# EAGLE design pingLED (EAGLE 9.3.1)
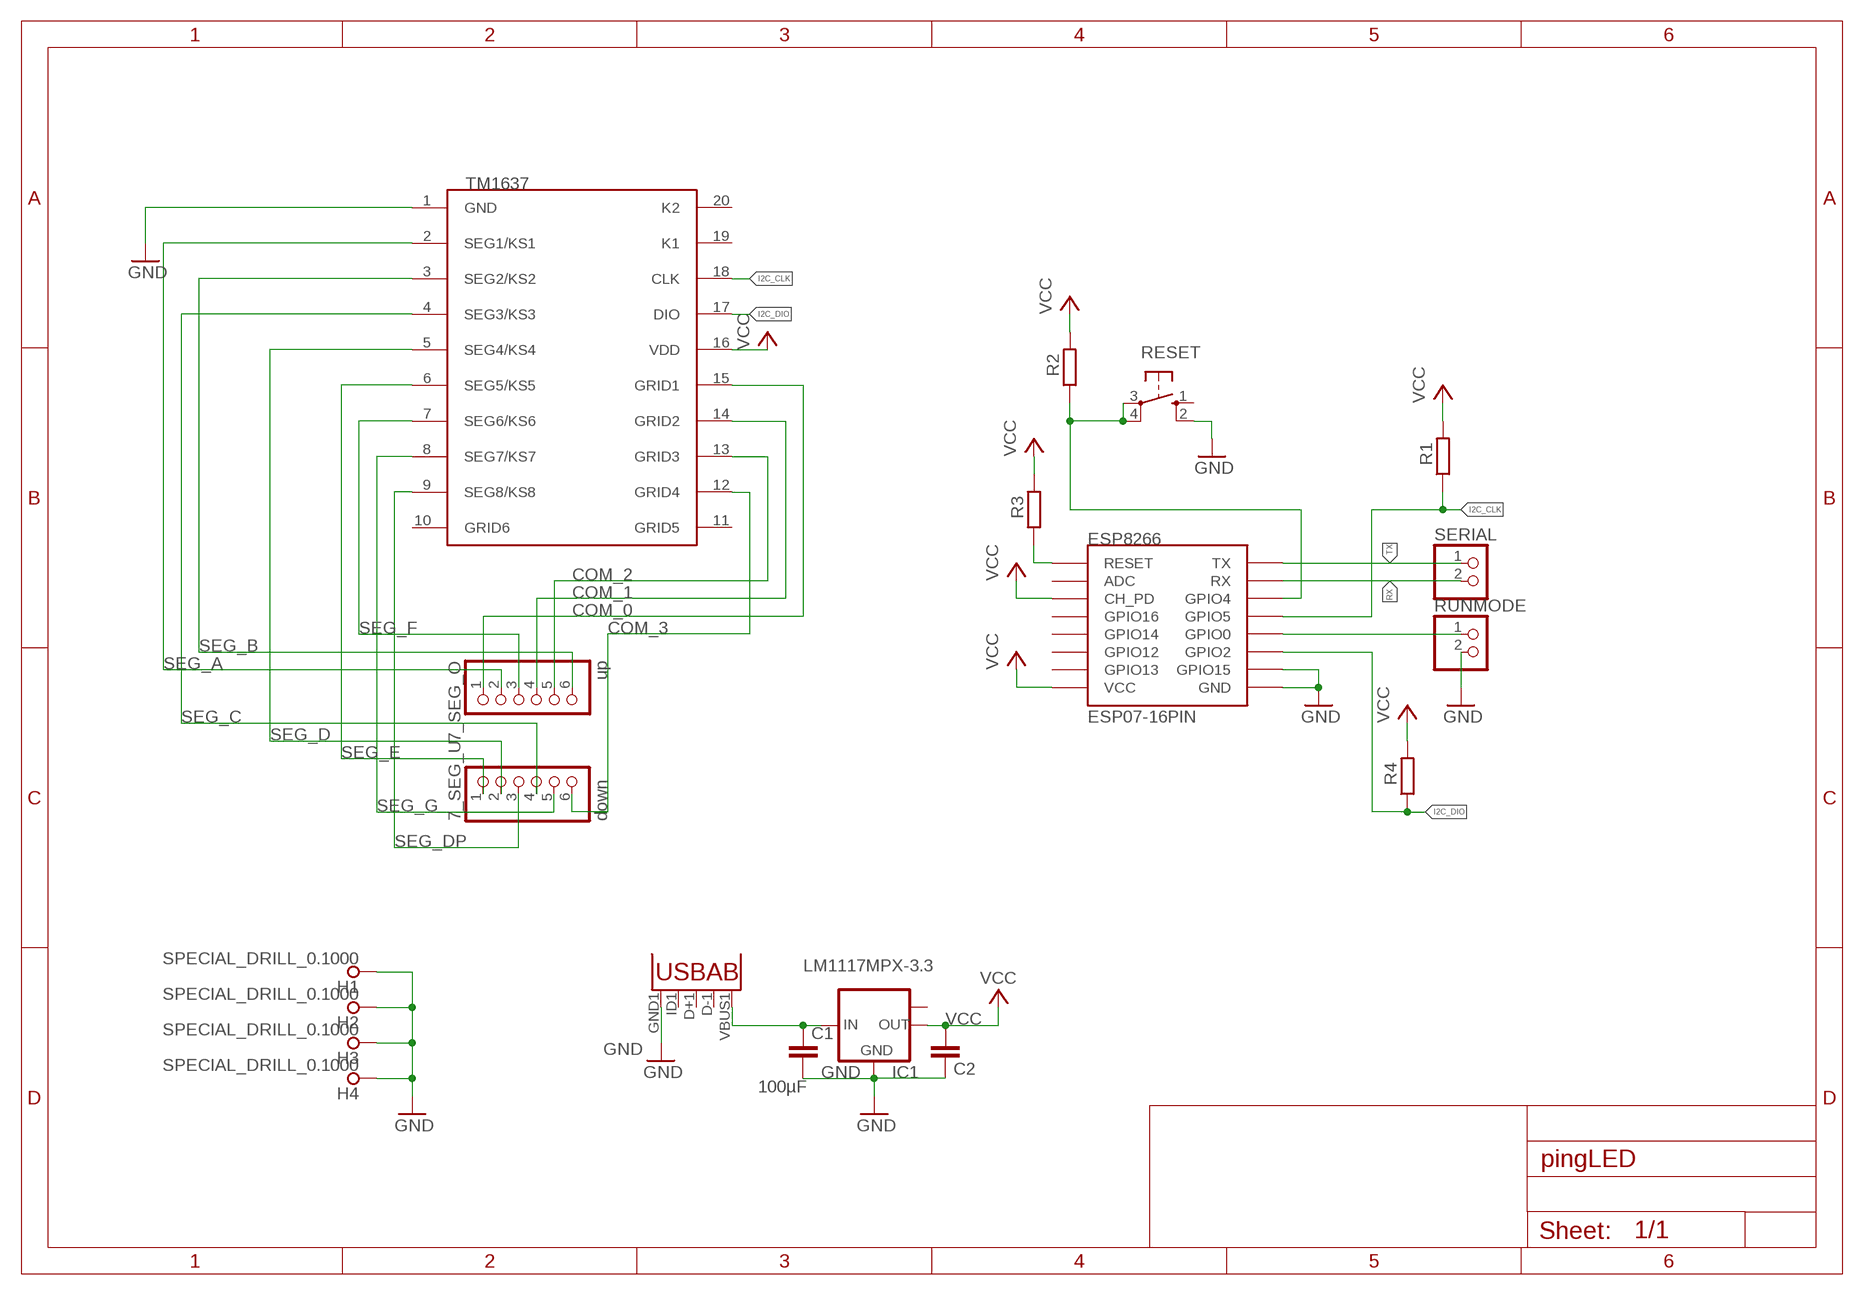
[diagram p0: schematic, sheet 1]

## Parts
7_SEG_O  up  PINHD-1X6  [1X06]
7_SEG_U  down  PINHD-1X6  [1X06]
7SEG_DRIVER  TM1637SOP20  [SOIC127P1045X255-20]
C1  100µF  C-EUC0603  [C0603]
C2  C-EUC0603  [C0603]
ESP8266  ESP07-16PIN  [ESP07-16PIN]
H1  SPECIAL_DRILL_0.1000  [PAD_0.1000]
H2  SPECIAL_DRILL_0.1000  [PAD_0.1000]
H3  SPECIAL_DRILL_0.1000  [PAD_0.1000]
H4  SPECIAL_DRILL_0.1000  [PAD_0.1000]
IC1  LM1117MPX-3.3  [SOT223]
R1  R-EU_R0603  [R0603]
R2  R-EU_R0603  [R0603]
R3  R-EU_R0603  [R0603]
R4  R-EU_R0603  [R0603]
RESET  10-XX  [B3F-10XX]
RUNMODE  PINHD-1X2  [1X02]
SERIAL  PINHD-1X2  [1X02]
U1  V_IN  USB""  [USB-MICRO-SMD]

## Nets
COM_0: 7_SEG_O.1 7SEG_DRIVER.15(GRID1)
COM_1: 7_SEG_O.4 7SEG_DRIVER.14(GRID2)
COM_2: 7_SEG_O.5 7SEG_DRIVER.13(GRID3)
COM_3: 7_SEG_U.6 7SEG_DRIVER.12(GRID4)
GND: 7SEG_DRIVER.1(GND) C1.2 C2.2 ESP8266.GND ESP8266.GPIO15 H1.1 H2.1 H3.1 H4.1 IC1.1(GND) RESET.2(S1) RUNMODE.2 U1.GND1(GND)
I2C_CLK: 7SEG_DRIVER.18(CLK) ESP8266.GPIO5 R1.1
I2C_DIO: 7SEG_DRIVER.17(DIO) ESP8266.GPIO2 R4.1
N$1: ESP8266.GPIO0 RUNMODE.1
N$2: ESP8266.GPIO4 R2.1 RESET.3(P) RESET.4(P1)
N$3: ESP8266.REST(RESET) R3.1
N$4: C1.1 IC1.3(IN) U1.VBUS1(VBUS)
RX: ESP8266.RX SERIAL.2
SEG_A: 7_SEG_O.2 7SEG_DRIVER.2(SEG1/KS1)
SEG_B: 7_SEG_O.6 7SEG_DRIVER.3(SEG2/KS2)
SEG_C: 7_SEG_U.4 7SEG_DRIVER.4(SEG3/KS3)
SEG_D: 7_SEG_U.2 7SEG_DRIVER.5(SEG4/KS4)
SEG_DP: 7_SEG_U.3 7SEG_DRIVER.9(SEG8/KS8)
SEG_E: 7_SEG_U.1 7SEG_DRIVER.6(SEG5/KS5)
SEG_F: 7_SEG_O.3 7SEG_DRIVER.7(SEG6/KS6)
SEG_G: 7_SEG_U.5 7SEG_DRIVER.8(SEG7/KS7)
TX: ESP8266.TX SERIAL.1
VCC: 7SEG_DRIVER.16(VDD) C2.1 ESP8266.CH_PD ESP8266.VCC IC1.2(OUT) R1.2 R2.2 R3.2 R4.2
Unconnected: 7SEG_DRIVER.10(GRID6) 7SEG_DRIVER.11(GRID5) 7SEG_DRIVER.19(K1) 7SEG_DRIVER.20(K2) ESP8266.ADC ESP8266.GPIO12 ESP8266.GPIO13 ESP8266.GPIO14 ESP8266.GPIO16 IC1.TAB(OUT1) RESET.1(S) U1.D+1(D+) U1.D-1(D-) U1.ID1(USBID)

## Library data of the parts
7_SEG_O 7_SEG_U = adafruit:PINHD-1X6: PIN HEADER
7SEG_DRIVER = esp8266:TM1637
C1 C2 = rcl:C-EU: CAPACITOR, European symbol; SPICEPREFIX: C
ESP8266 = esp8266:ESP07-16PIN: ESP8266 Wifi module 07 - 16 pins; DIMENSIONS: 22.0 x 16.0 mm; PINS: 16; PITCH: 0.078" / 2 mm
H1-H4 = special-drill:SPECIAL_DRILL_: Special drills
IC1 = lm1117:LM1117MPX-*
R1-R4 = rcl:R-EU_: RESISTOR, European symbol; SPICEPREFIX: R
RESET = switch-omron:10-XX: OMRON SWITCH; MPN: B3F-1000; OC_FARNELL: 176432; OC_NEWARK: 36M3542
RUNMODE SERIAL = pinhead:PINHD-1X2: PIN HEADER
U1 = MicroUSB:USB: This is a USB AB connector that is compatible with USB OTG. i.e. this connector can serve as a host or device

## Board
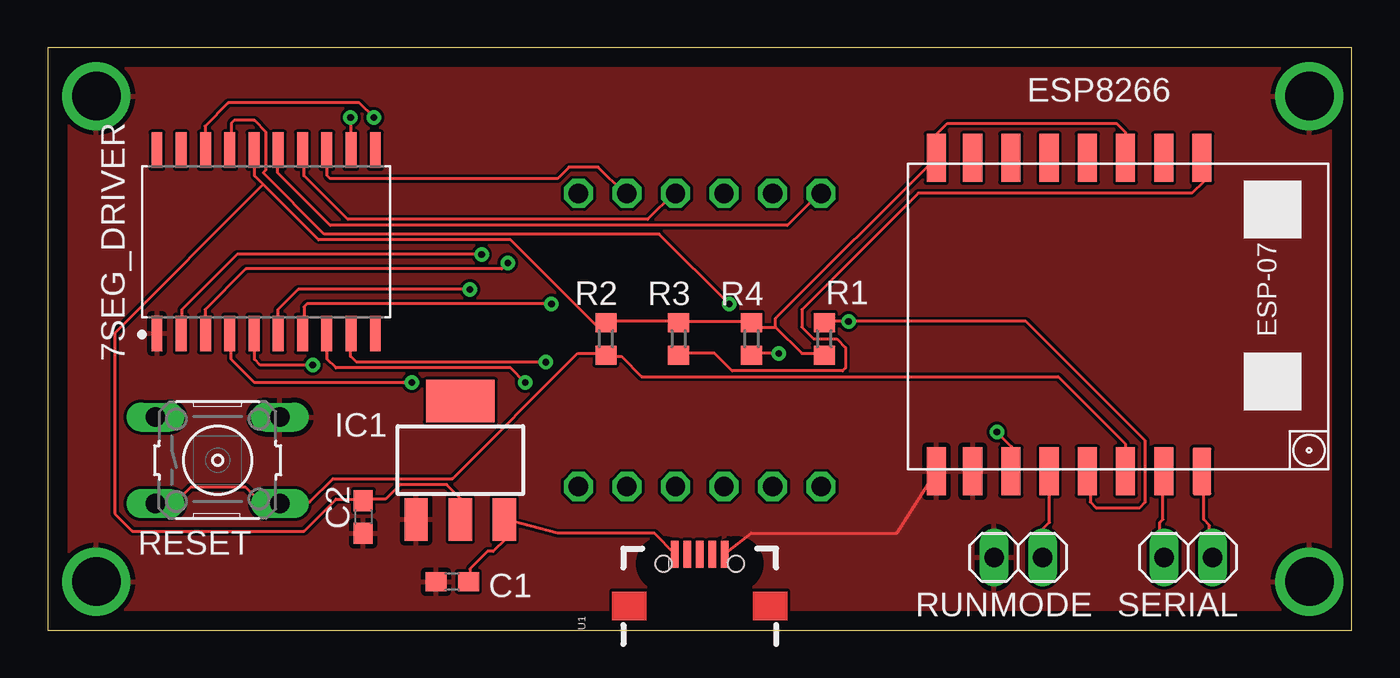
[diagram p1: board, top side]
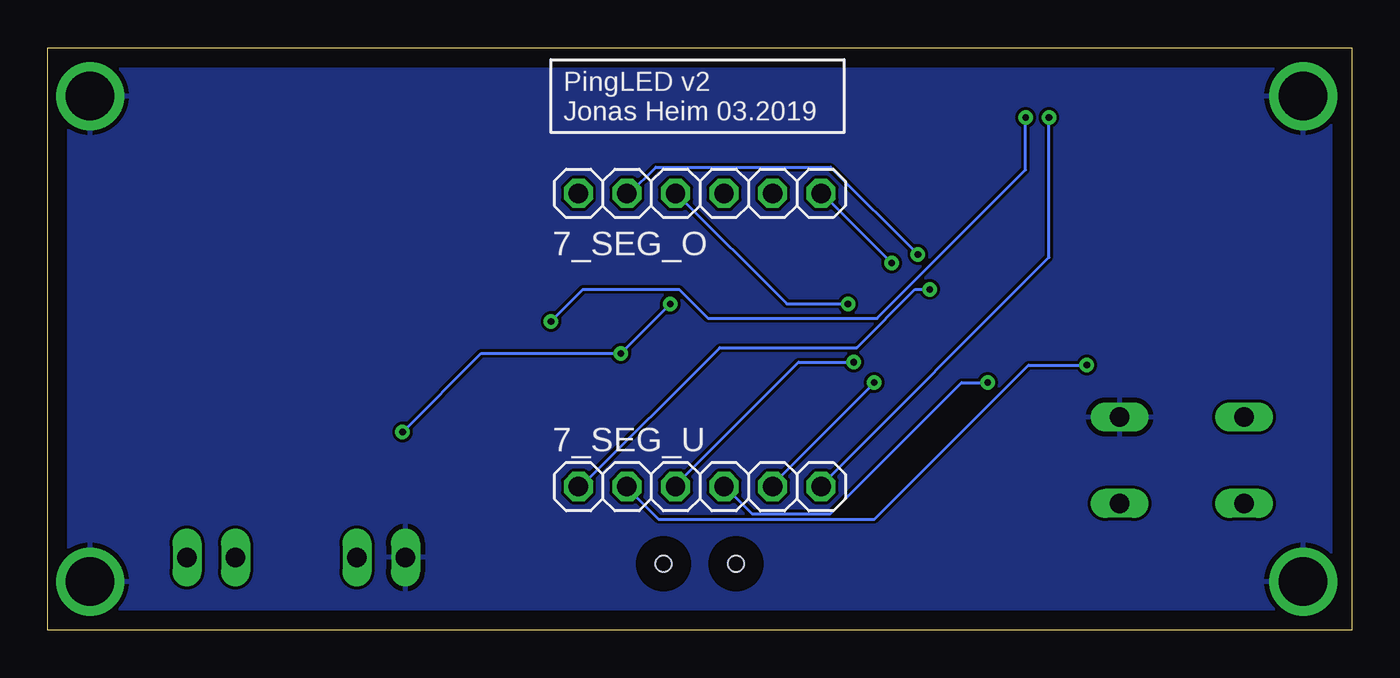
[diagram p2: board, bottom side, seen from below]

Size 68.25 x 30.47 mm. Coordinates in mm from the lower left corner, seen from the top.
Outline: 0,0 68.25,0 68.25,30.47 0,30.47 0,0
Copper layers (1*16): Top 0.035mm / dielectric 1.5mm / Bottom 0.035mm
Design rules "default *": minimum track width 6mil, minimum drill 0.35mm, track to track 6mil, track to pad 6mil, pad to pad 6mil, via to via 12mil, smd to smd 6mil, copper to edge 40mil, drill to drill 6mil, minimum pad ring 10mil, minimum via ring 8mil, stop-mask expansion 4mil, vias tented up to drill 0mil, thermal gap 10mil

### Footprints (pad centres in the part's own frame; a part is rotated, then mirrored left to right if it is on the bottom)
1X06 = drill 1.016 octagon: 1 -6.35,0; 2 -3.81,0; 3 -1.27,0; 4 1.27,0; 5 3.81,0; 6 6.35,0
SOIC127P1045X255-20 = smd 1.865 x 0.572: 1 -4.798,5.715; 2 -4.798,4.445; 3 -4.798,3.175; 4 -4.798,1.905; 5 -4.798,0.635; 6 -4.798,-0.635; 7 -4.798,-1.905; 8 -4.798,-3.175; 9 -4.798,-4.445; 10 -4.798,-5.715; 11 4.798,-5.715; 12 4.798,-4.445; 13 4.798,-3.175; 14 4.798,-1.905; 15 4.798,-0.635; 16 4.798,0.635; 17 4.798,1.905; 18 4.798,3.175; 19 4.798,4.445; 20 4.798,5.715
C0603 = smd 1.1 x 1: 1 -0.85,0; 2 0.85,0
ESP07-16PIN = smd 2.5 x 1: ADC -8.2,3.8; CH_PD -8.2,1.8; GND 8.2,-8.105; GPIO0 8.2,-2.2; GPIO2 8.2,-4.2; GPIO4 8.2,1.8; GPIO5 8.2,-0.2; GPIO12 -8.2,-4.2; GPIO13 -8.2,-6.2; GPIO14 -8.2,-2.2; GPIO15 8.2,-6.2; GPIO16 -8.2,-0.2; REST -8.2,5.8; RX 8.2,3.8; TX 8.2,5.8; VCC -8.2,-8.105
PAD_0.1000 = drill 2.54 pad 2.54: 1 0,0
SOT223 = smd 1.219 x 2.235: 1 -2.311,-3.099; 2 0,-3.099; 3 2.311,-3.099 | smd 3.6 x 2.2: TAB 0,3.099
R0603 = smd 1 x 1.1: 1 -0.85,0; 2 0.85,0
B3F-10XX = drill 1.016 long: 1 -3.251,2.261; 2 3.251,2.261; 3 -3.251,-2.261; 4 3.251,-2.261
1X02 = drill 1.016 long: 1 -1.27,0; 2 1.27,0
USB-MICRO-SMD = smd 1.4 x 0.4: D+1 2.7,0; D-1 2.7,0.65; GND1 2.7,-1.3; ID1 2.7,-0.65; VBUS1 2.7,1.3 | hole 0.85: 2.2,1.9; 2.2,-1.9

### Placement (x,y rotation side)
7_SEG_O  34.12,22.85 0 bottom
7_SEG_U  34.12,7.51 0 bottom
7SEG_DRIVER  11.43,20.32 90 top
C1  21.17,2.54 180 top
C2  16.51,5.93 270 top
ESP8266  54.61,16.51 270 top
H1  2.54,2.54 0 top
H2  66.04,2.54 0 top
H3  2.54,27.94 0 top
H4  66.04,27.94 0 top
IC1  21.59,8.89 0 top
R1  40.64,15.24 270 top
R2  29.21,15.24 90 top
R3  33.02,15.24 90 top
R4  36.83,15.24 90 top
RESET  8.89,8.89 0 top
RUNMODE  50.8,3.81 180 top
SERIAL  59.69,3.81 180 top
U1  34.12,1.27 90 top

### Tracks (layer width: path | path; a pad name or v marks a point on that pad's centre or on a via)
COM_0
  Top 0.152: 7SEG_DRIVER.15 12.04,24.99 12.04,23.93 14.78,21.18 38.71,21.18 40.39,22.86 7_SEG_O.1
COM_1
  Top 0.152: 7SEG_DRIVER.14 13.41,24.99 13.41,23.77 15.7,21.49 31.39,21.49 32.77,22.86 7_SEG_O.4
COM_2
  Top 0.152: 7SEG_DRIVER.13 14.63,24.99 14.63,23.77 14.78,23.62 26.67,23.62 27.28,24.23 28.8,24.23 30.18,22.86 7_SEG_O.5
COM_3  (via drill 0.35)
  Top 0.152: v15.85,26.82 15.85,25.15 7SEG_DRIVER.12
  Bottom 0.152: v15.85,26.82 15.85,19.51 27.74,7.62 7_SEG_U.6
GND
  Top 0.152: U1.GND1 36.83,5.08 44.45,5.08 ESP8266.GND
  pour Top: 0,30.48 0,0 68.58,0 68.58,30.48
  pour Bottom: 0,30.48 0,0 68.58,0 68.58,30.48
I2C_CLK  (via drill 0.35)
  Top 0.152: R1.1 40.69,16.15 v41.91,16.15 51.21,16.15 57.45,9.91 57.45,6.71 57.15,6.4 54.86,6.4 54.56,6.71 54.56,8.23 ESP8266.GPIO5 | v17.07,26.82 16.31,27.58 9.45,27.58 8.23,26.36 8.23,25.15 7SEG_DRIVER.18
  Bottom 0.152: v17.07,26.82 17.07,24.08 24.84,16.31 33.68,16.31 35.2,17.83 40.23,17.83 v41.91,16.15
I2C_DIO  (via drill 0.35)
  Top 0.152: v38.25,14.48 36.88,14.48 R4.1 | v49.68,10.36 50.44,9.6 50.44,8.38 ESP8266.GPIO2 | v35.66,17.07 32,20.73 14.48,20.73 11.28,23.93 11.43,24.08 11.43,26.06 10.82,26.67 9.75,26.67 9.6,26.52 9.6,25.15 7SEG_DRIVER.17
  Bottom 0.152: v49.68,10.36 45.57,14.48 v38.25,14.48 v35.66,17.07
N$1
  Top 0.152: ESP8266.GPIO0 52.43,8.23 52.43,5.64 52.12,5.33 52.12,3.81 RUNMODE.1
N$2
  Top 0.152: ESP8266.GPIO4 56.39,8.38 56.39,9.75 52.88,13.26 31.09,13.26 30.02,14.33 29.26,14.33 R2.1 29.11,14.48 27.74,14.48 21.18,7.92 14.94,7.92 13.72,6.71 12.19,6.71 RESET.4 12.04,6.71 11.12,6.71 10.36,7.47 7.47,7.47 6.71,6.71 5.64,6.71 RESET.3
N$3
  Top 0.152: R3.1 33.07,14.48 34.9,14.48 35.81,13.56 41.6,13.56 41.76,13.72 41.76,14.78 41.3,15.24 40.08,15.24 39.47,15.85 39.47,16.76 45.57,22.86 59.89,22.86 60.5,23.47 60.5,24.69 ESP8266.REST
N$4
  Top 0.152: U1.VBUS1 31.75,5.08 26.67,5.08 IC1.3 23.93,5.64 23.93,4.72 23.32,4.12 23.01,4.12 22.1,3.2 22.1,2.59 C1.1
RX
  Top 0.152: ESP8266.RX 58.37,8.23 58.37,5.79 58.22,5.64 58.22,3.96 58.37,3.81 SERIAL.2
SEG_A  (via drill 0.35)
  Top 0.152: v22.71,19.66 9.91,19.66 7.01,16.76 7.01,15.54 7SEG_DRIVER.2
  Bottom 0.152: v22.71,19.66 27.28,24.23 36.42,24.23 37.8,22.86 7_SEG_O.2
SEG_B  (via drill 0.35)
  Top 0.152: v24.08,19.2 23.77,18.9 10.36,18.9 8.23,16.76 8.23,15.54 7SEG_DRIVER.3
  Bottom 0.152: v24.08,19.2 27.74,22.86 7_SEG_O.6
SEG_C  (via drill 0.35)
  Top 0.152: v19.05,12.95 10.82,12.95 9.6,14.17 9.6,15.39 7SEG_DRIVER.4
  Bottom 0.152: v19.05,12.95 20.42,12.95 27.28,6.1 31.39,6.1 32.77,7.47 7_SEG_U.4
SEG_D  (via drill 0.35)
  Top 0.152: v13.87,13.87 11.12,13.87 10.82,14.17 10.82,15.39 7SEG_DRIVER.5
  Bottom 0.152: v13.87,13.87 16.92,13.87 24.99,5.79 36.27,5.79 37.95,7.47 7_SEG_U.2
SEG_DP  (via drill 0.35)
  Top 0.152: v26.06,14.02 16.15,14.02 15.85,14.33 15.85,15.39 7SEG_DRIVER.9
  Bottom 0.152: v26.06,14.02 28.96,14.02 35.36,7.62 7_SEG_U.3
SEG_E  (via drill 0.35)
  Top 0.152: v22.1,17.83 13.11,17.83 12.04,16.76 12.04,15.54 7SEG_DRIVER.6
  Bottom 0.152: v22.1,17.83 22.86,17.83 25.91,14.78 33.07,14.78 40.39,7.47 7_SEG_U.1
SEG_F  (via drill 0.35)
  Top 0.152: v26.36,17.07 13.56,17.07 13.41,16.92 13.41,15.54 7SEG_DRIVER.7
  Bottom 0.152: v26.36,17.07 29.57,17.07 35.36,22.86 7_SEG_O.3
SEG_G  (via drill 0.35)
  Top 0.152: v24.99,12.95 24.23,13.72 15.09,13.72 14.63,14.17 14.63,15.39 7SEG_DRIVER.8
  Bottom 0.152: v24.99,12.95 30.33,7.62 7_SEG_U.5
TX
  Top 0.152: SERIAL.1 60.81,3.96 60.81,5.49 60.5,5.79 60.5,8.23 ESP8266.TX
VCC
  Top 0.152: IC1.2 21.64,5.79 21.64,6.86 20.88,7.62 18.44,7.62 17.68,6.86 16.61,6.86 C2.1 16.46,6.86 15.09,6.86 13.41,5.18 4.42,5.18 3.5,6.1 3.5,15.54 11.28,23.32 | 38.1,15.85 39.47,14.48 40.54,14.48 R1.2 | 38.1,15.85 37.03,15.85 36.88,16 R4.2 36.73,16.15 33.07,16.15 R3.2 32.92,16.15 29.26,16.15 R2.2 29.11,16 28.65,16 24.23,20.42 14.17,20.42 11.28,23.32 | 11.28,23.32 10.82,23.77 10.82,24.99 7SEG_DRIVER.16 | 38.1,15.85 38.1,16.31 46.48,24.69 ESP8266.VCC 46.48,24.84 46.48,25.91 47.09,26.52 55.93,26.52 56.39,26.06 56.39,24.84 ESP8266.CH_PD

### Text on the board
bNames: PingLED v2 / Jonas Heim 03.2019
tValues: TX | RX